# EAGLE schematic jsbx 11 controls (EAGLE 6.1)
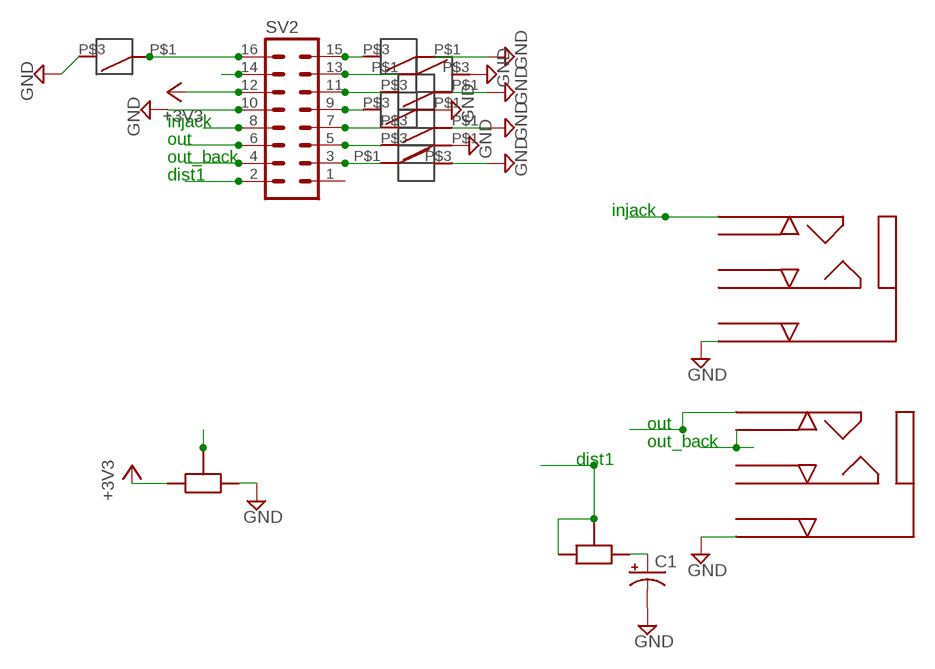
[diagram p0: schematic, sheet 1]

## Parts
B1  SPDT_TOPHAT  [SPDT_TOPHAT]
B2  SPDT_TOPHAT  [SPDT_TOPHAT]
B3  SPDT_TOPHAT  [SPDT_TOPHAT]
B4  SPDT_TOPHAT  [SPDT_TOPHAT]
B5  SPDT_TOPHAT  [SPDT_TOPHAT]
B6  SPDT_TOPHAT  [SPDT_TOPHAT]
B7  SPDT_TOPHAT  [SPDT_TOPHAT]
B8  SPDT_TOPHAT  [SPDT_TOPHAT]
C1  CPOL-USE2.5-7  [E2,5-7]
SV2  MA08-2  [MA08-2]
U$12  POT  [POT]
U$13  POT  [POT]
U$14  1/4STEREO  [1/4STEREO]
U$15  1/4STEREO  [1/4STEREO]

## Nets
+3V3: SV2.12 U$12.P$1
B1: SV2.14 U$12.P$2
DIST1: SV2.2 U$13.P$1 U$13.P$2
GND: B1.P$1 B2.P$3 B3.P$1 B4.P$1 B5.P$3 B6.P$1 B7.P$1 B8.P$3 C1.- SV2.10 U$12.P$3 U$14.P$1 U$15.P$1
GPOT: B4.P$3 SV2.9
IN_JACK: SV2.8 U$14.P$3
N$4: C1.+ U$13.P$3
N$6: B3.P$3 SV2.11
N$7: B2.P$1 SV2.13
N$8: B1.P$3 SV2.15
N$10: B5.P$1 SV2.16
N$11: B6.P$3 SV2.7
N$12: B7.P$3 SV2.5
N$32: B8.P$1 SV2.3
OUT: SV2.6 U$15.P$3
OUT_BACK: SV2.4 U$15.P$6
Unconnected: SV2.1 U$14.P$2 U$14.P$4 U$14.P$5 U$14.P$6 U$15.P$2 U$15.P$4 U$15.P$5

## Notes on the sheet
- injack
- out
- out_back
- dist1
- injack
- out
- out_back
- dist1

## Library data of the parts
B1-B8 = BLEEP:SPDT_TOPHAT: a; A: a
C1 = rcl:CPOL-US: POLARIZED CAPACITOR, American symbol
SV2 = con-lstb:MA08-2: PIN HEADER; OC_FARNELL: unknown; OC_NEWARK: unknown
U$12 U$13 = BLEEP:POT
U$14 U$15 = BLEEP:1/4STEREO